# Altium schematic sheet DisplayDriver.SchDoc
size A4
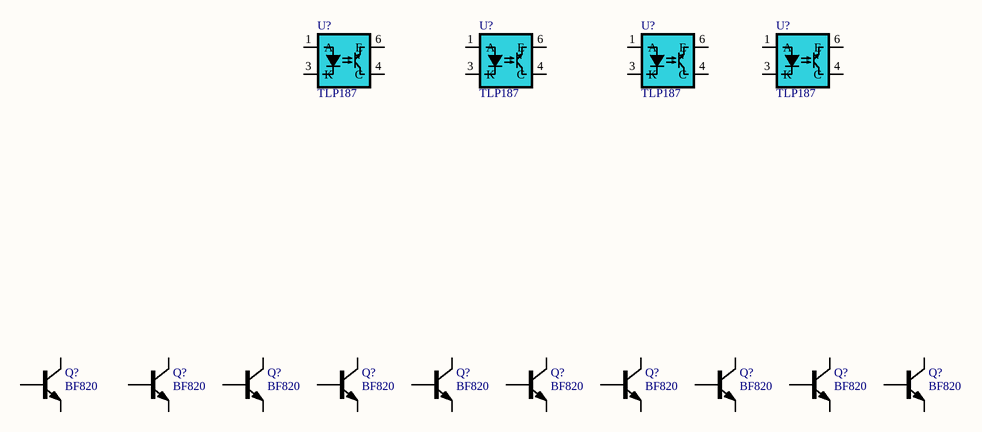
[diagram p0: DisplayDriver.SchDoc]

## Parts
(Parts that share a designator on the sheet are numbered #1, #2 ... from top to bottom, then left to right.)
Q?#1  BF820  [SOT95P230X124-3N]
Q?#2  BF820  [SOT95P230X124-3N]
Q?#3  BF820  [SOT95P230X124-3N]
Q?#4  BF820  [SOT95P230X124-3N]
Q?#5  BF820  [SOT95P230X124-3N]
Q?#6  BF820  [SOT95P230X124-3N]
Q?#7  BF820  [SOT95P230X124-3N]
Q?#8  BF820  [SOT95P230X124-3N]
Q?#9  BF820  [SOT95P230X124-3N]
Q?#10  BF820  [SOT95P230X124-3N]
U?#1  TLP187  [SOP127P700X220-4_6N]
U?#2  TLP187  [SOP127P700X220-4_6N]
U?#3  TLP187  [SOP127P700X220-4_6N]
U?#4  TLP187  [SOP127P700X220-4_6N]

## Nets

Not connected (* = marked no-connect by the designer): Q?#1 1(B) 2(E) 3(C); Q?#2 1(B) 2(E) 3(C); Q?#3 1(B) 2(E) 3(C); Q?#4 1(B) 2(E) 3(C); Q?#5 1(B) 2(E) 3(C); Q?#6 1(B) 2(E) 3(C); Q?#7 1(B) 2(E) 3(C); Q?#8 1(B) 2(E) 3(C); Q?#9 1(B) 2(E) 3(C); Q?#10 1(B) 2(E) 3(C); U?#1 1(A) 3(K) 4(C) 6(E); U?#2 1(A) 3(K) 4(C) 6(E); U?#3 1(A) 3(K) 4(C) 6(E); U?#4 1(A) 3(K) 4(C) 6(E)

## Library data of the parts
Q?#1-Q?#10 = NPN BF820 300V 0.05A SOT23-3: NEXPERIA - BF820 - TRANSISTOR, NPN, SOT-23; Package / Case: TO-236-3, SC-59, SOT-23-3; Supplier 1: Farnell; Supplier Part Number 1: 1081284; Manufacturer Part Number: BF820; Manufacturer: NEXPERIA
U?#1-U?#4 = IC OPTOCOUPLER TLP187: TOSHIBA - TLP187 - OPTOCOUPLER, DARLINGTON, 3.75KV, SMDIP-4; Revision: 17-Jul-2002: Re-released for DXP Platform.; Supplier 1: Farnell; Supplier Part Number 1: 2524263; Manufacturer: TOSHIBA; Manufacturer Part Number: TLP187